# EAGLE schematic motor-driver (EAGLE 7.3.0)
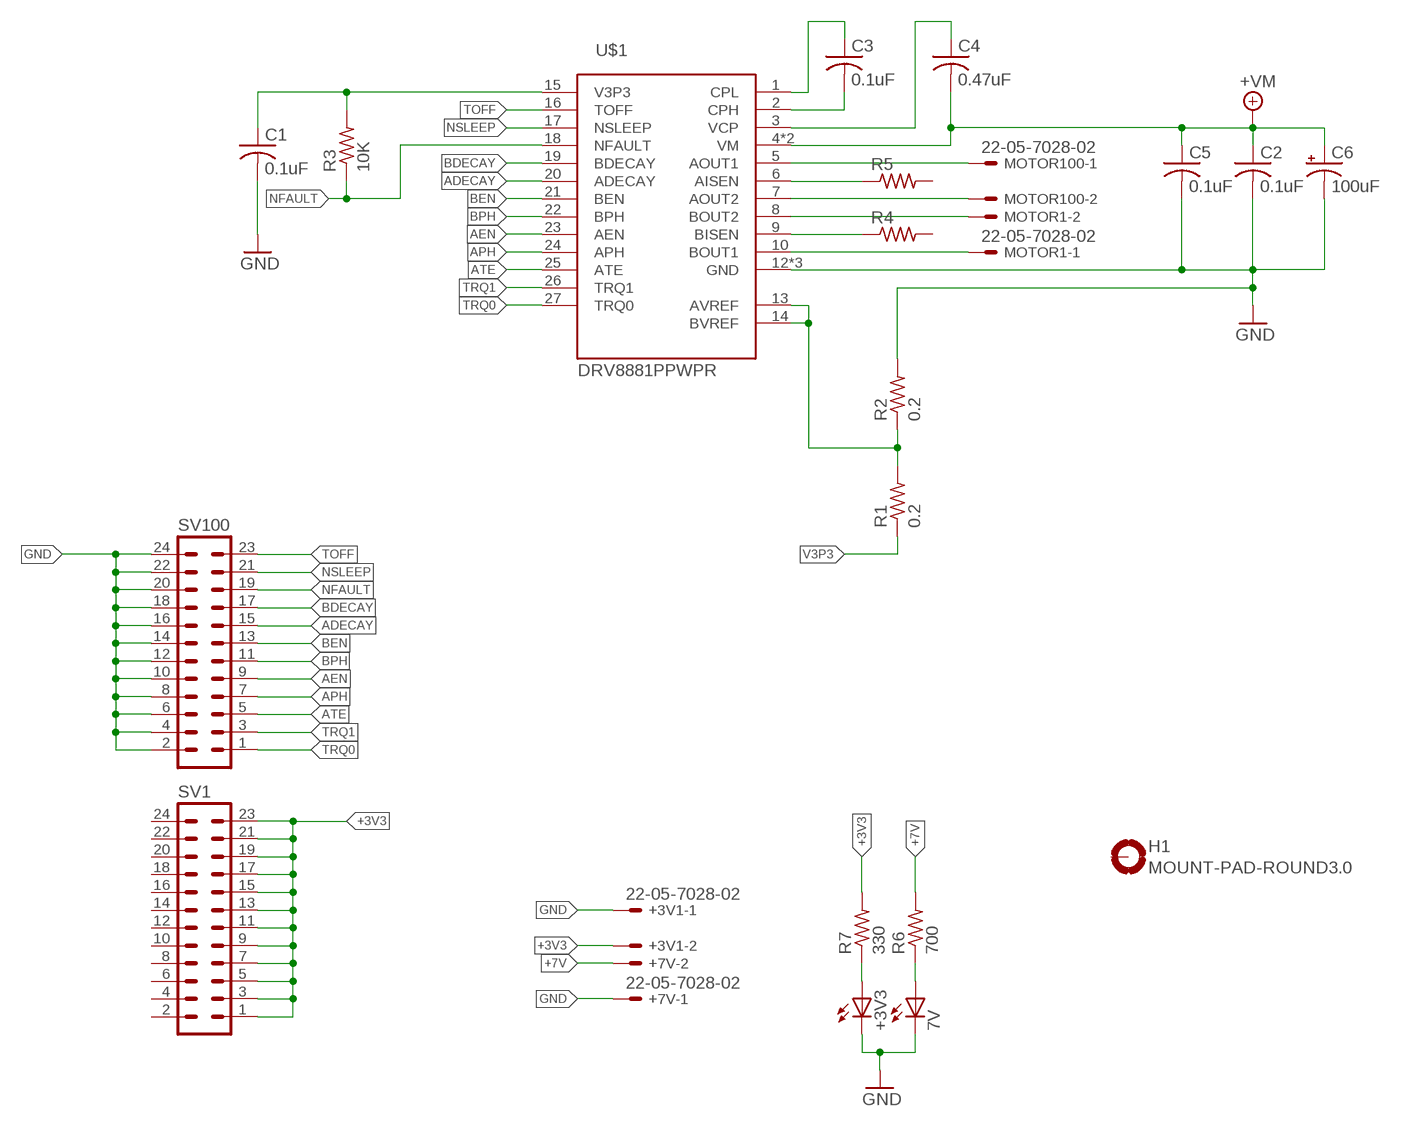
[diagram p0: schematic, sheet 1]

## Parts
7V  LEDCHIP-LED0603  [CHIP-LED0603]
+3V1  22-05-7028-02  [7395-02]
+3V3  LEDCHIP-LED0603  [CHIP-LED0603]
+7V  22-05-7028-02  [7395-02]
C1  0.1uF  C-USC0402  [C0402]
C2  0.1uF  C-USC0402  [C0402]
C3  0.1uF  C-USC0402  [C0402]
C4  0.47uF  C-USC0402  [C0402]
C5  0.1uF  C-USC0402  [C0402]
C6  100uF  100UF-10V-10%(TANT)  [EIA7343]
H1  MOUNT-PAD-ROUND3.0  [3,0-PAD]
MOTOR1  22-05-7028-02  [7395-02]
MOTOR100  22-05-7028-02  [7395-02]
R1  0.2  R-US_R0402  [R0402]
R2  0.2  R-US_R0402  [R0402]
R3  10K  R-US_R1206  [R1206]
R4  R-US_R1206  [R1206]
R5  R-US_R1206  [R1206]
R6  700  R-US_R0402  [R0402]
R7  330  R-US_R0402  [R0402]
SV1  MA12-2  [MA12-2]
SV100  MA12-2  [MA12-2]
U$1  DRV8881PPWPR  [TSSOP-28]

## Nets
+3V3: +3V1.2 R7.2 SV1.1 SV1.3 SV1.5 SV1.7 SV1.9 SV1.11 SV1.13 SV1.15 SV1.17 SV1.19 SV1.21 SV1.23
+7V [VM]: +7V.2 C2.1 C4.2 C5.1 C6.A(+) R6.2 U$1.4(VM) U$1.11(VM) ; supply symbol labelled +VM
ADECAY: SV100.15 U$1.20(ADECAY)
AEN: SV100.9 U$1.23(AEN)
APH: SV100.7 U$1.24(APH)
ATE: SV100.5 U$1.25(ATE)
BDECAY: SV100.17 U$1.19(BDECAY)
BEN: SV100.13 U$1.21(BEN)
BPH: SV100.11 U$1.22(BPH)
GND: 7V.C +3V1.1 +3V3.C +7V.1 C1.2 C2.2 C5.2 C6.C(-) R2.2 SV100.2 SV100.4 SV100.6 SV100.8 SV100.10 SV100.12 SV100.14 SV100.16 SV100.18 SV100.20 SV100.22 SV100.24 U$1.12(GND) U$1.28(GND) U$1.EXP(GND)
N$1: R4.1 U$1.9(BISEN)
N$2: R5.1 U$1.6(AISEN)
N$3: MOTOR100.1 U$1.5(AOUT1)
N$5: MOTOR100.2 U$1.7(AOUT2)
N$6: MOTOR1.2 U$1.8(BOUT2)
N$7: MOTOR1.1 U$1.10(BOUT1)
N$8: C3.2 U$1.2(CPH)
N$9: C3.1 U$1.1(CPL)
N$10: C4.1 U$1.3(VCP)
N$11: +3V3.A R7.1
N$12: 7V.A R6.1
N$18: R1.2 R2.1 U$1.13(AVREF) U$1.14(BVREF)
NFAULT: R3.1 SV100.19 U$1.18(NFAULT)
NSLEEP: SV100.21 U$1.17(NSLEEP)
TOFF: SV100.23 U$1.16(TOFF)
TRQ0: SV100.1 U$1.27(TRQ0)
TRQ1: SV100.3 U$1.26(TRQ1)
V3P3: C1.1 R1.1 R3.2 U$1.15(V3P3)
Unconnected: H1.B3,0(MOUNT) R4.2 R5.2 SV1.2 SV1.4 SV1.6 SV1.8 SV1.10 SV1.12 SV1.14 SV1.16 SV1.18 SV1.20 SV1.22 SV1.24

## Library data of the parts
7V +3V3 = led:LED: LED OSRAM: - CHIPLED LG R971, LG N971, LY N971, LG Q971, LY Q971, LO R971, LY R971 LH N974, LH R974 LS Q976, LO Q976, LY Q976 LO Q996 - Hyper CHIPLED LW Q18S LB Q993, LB Q99A, LB R99A - SideLED LS A670, LO A670, LY A670, LG A670, LP A670 LB A673, LV A673, LT A673, LW A673 LH A674 LY A675 LS A676, LA A676, LO A676, LY A676, LW A676 LS A679, LY A679, LG A679 - Hyper Micro SIDELED® LS Y876, LA Y876, LO Y876, LY Y876 LT Y87S - SmartLED LW L88C, LW L88S LB L89C, LB L89S, LG L890 LS L89K, LO L89K, LY L89K LS L896, LA L896, LO L896, LY L896 - TOPLED LS T670, LO T670, LY T670, LG T670, LP T670 LSG T670, LSP T670, LSY T670, LOP T670, LYG T670 LG T671, LOG T671, LSG T671 LB T673, LV T673, LT T673, LW T673 LH T674 LS T676, LA T676, LO T676, LY T676, LB T676, LH T676, LSB T676, LW T676 LB T67C, LV T67C, LT T67C, LS T67K, LO T67K, LY T67K, LW E67C LS E67B, LA E67B, LO E67B, LY E67B, LB E67C, LV E67C, LT E67C LW T67C LS T679, LY T679, LG T679 LS T770, LO T770, LY T770, LG T770, LP T770 LB T773, LV T773, LT T773, LW T773 LH T774 LS E675, LA E675, LY E675, LS T675 LS T776, LA T776, LO T776, LY T776, LB T776 LHGB T686 LT T68C, LB T68C - Hyper Mini TOPLED® LB M676 - Mini TOPLED Santana® LG M470 LS M47K, LO M47K, LY M47K Source: http://www.osram.convergy.de LUXEON: - LUMILED® LXK2-PW12-R00, LXK2-PW12-S00, LXK2-PW14-U00, LXK2-PW14-V00 LXK2-PM12-R00, LXK2-PM12-S00, LXK2-PM14-U00 LXK2-PE12-Q00, LXK2-PE12-R00, LXK2-PE12-S00, LXK2-PE14-T00, LXK2-PE14-U00 LXK2-PB12-K00, LXK2-PB12-L00, LXK2-PB12-M00, LXK2-PB14-N00, LXK2-PB14-P00, LXK2-PB14-Q00 LXK2-PR12-L00, LXK2-PR12-M00, LXK2-PR14-Q00, LXK2-PR14-R00 LXK2-PD12-Q00, LXK2-PD12-R00, LXK2-PD12-S00 LXK2-PH12-R00, LXK2-PH12-S00 LXK2-PL12-P00, LXK2-PL12-Q00, LXK2-PL12-R00 Source: www.luxeon.com KINGBRIGHT: KA-3528ASYC Source: www.kingbright.com
+3V1 +7V MOTOR1 MOTOR100 = Son_of_Dark_Power:22-?-02: CONNECTOR wire to board 2.54 mm (.1 inch) pitch header; OC_FARNELL: 9731601; OC_NEWARK: unknown
C1-C5 = rcl:C-US: CAPACITOR, American symbol
C6 = SparkFun-Capacitors:100UF-10V-10%(TANT): CAP-07890; PROD_ID: CAP-07890
H1 = holes:MOUNT-PAD-ROUND: MOUNTING PAD, round
R1-R7 = rcl:R-US_: RESISTOR, American symbol
SV1 SV100 = con-lstb:MA12-2: PIN HEADER; OC_FARNELL: unknown; OC_NEWARK: unknown
U$1 = motor-driver:DRV8881PPWPR

## Net classes
0 default: width 0.203 mm, drill 0.33 mm, clearance 0.254 mm
1 +3v3: width 0.203 mm, drill 0.33 mm, clearance 0.254 mm
2 VM: width 0.508 mm, drill 0.533 mm, clearance 0.254 mm